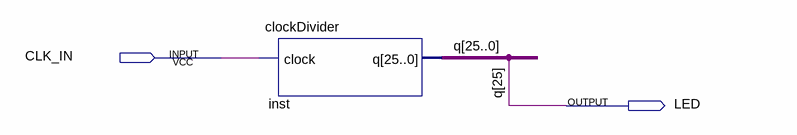
[diagram p0: schematic sheet]
// Quartus schematic clock.bdf as structural Verilog: 1 symbols, 2 pins
module clock (
  input  CLK_IN,
  output LED
);

  wire [24:0] q;

  clockDivider inst (.clock(CLK_IN), .q({LED, q}));

  // Other names for the same wires on the sheet: q[25] = LED
endmodule
